# Altium project peggy-optical-board.PrjPcb
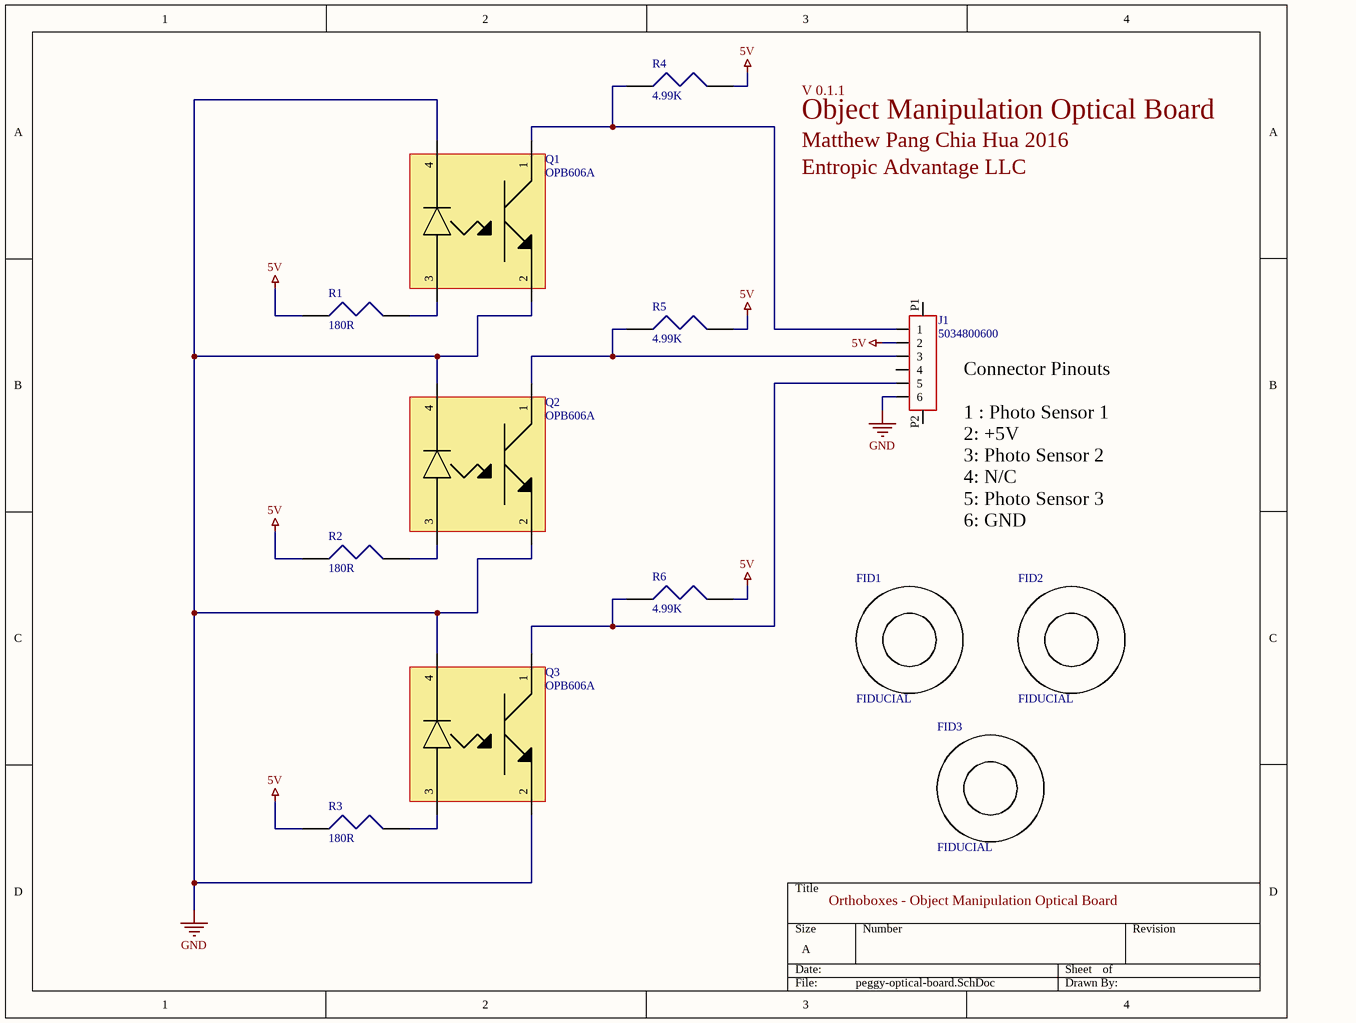
[diagram p0: peggy-optical-board.SchDoc]
1 sheet, 13 parts. Net scope: global (net labels, ports and power ports of the same name join across sheets).
Board file: peggy-optical-board.PcbDoc

## Sheet peggy-optical-board.SchDoc
size A

### Parts
FID1  FIDUCIAL  [FID]  (no BOM)
FID2  FIDUCIAL  [FID]  (no BOM)
FID3  FIDUCIAL  [FID]  (no BOM)
J1  5034800600  [MOLEX 503480-0600]
Q1  OPB606A  [OPB606A]
Q2  OPB606A  [OPB606A]
Q3  OPB606A  [OPB606A]
R1  180R  [RESC2012X07N_SAMSUNG]
R2  180R  [RESC2012X07N_SAMSUNG]
R3  180R  [RESC2012X07N_SAMSUNG]
R4  4.99K  [RESC2012X07N_SAMSUNG]
R5  4.99K  [RESC2012X07N_SAMSUNG]
R6  4.99K  [RESC2012X07N_SAMSUNG]

### Nets
5V: J1.2 R1.1 R2.1 R3.1 R4.2 R5.2 R6.2
GND: J1.6 Q1.2 Q1.4 Q2.2 Q2.4 Q3.2 Q3.4
NetJ1_1: J1.1 Q1.1 R4.1
NetJ1_3: J1.3 Q2.1 R5.1
NetJ1_5: J1.5 Q3.1 R6.1
NetQ1_3: Q1.3 R1.2
NetQ2_3: Q2.3 R2.2
NetQ3_3: Q3.3 R3.2

Not connected (* = marked no-connect by the designer): J1 4 P1 P2

### Notes on the sheet
- V 0.1.1
- Object Manipulation Optical Board
- Matthew Pang Chia Hua 2016
- Entropic Advantage LLC
- (near J1) Connector Pinouts
  1 : Photo Sensor 1
  2: +5V
  3: Photo Sensor 2
  4: N/C
  5: Photo Sensor 3
  6: GND
- Orthoboxes - Object Manipulation Optical Board

### Library data of the parts
FID1-FID3 = Fiducial 1
J1 = 5034800600: CONN FFC FPC 6POS 0.50MM R/A; Manufacturer: Molex, LLC; Flat Flex Type: FFC, FPC; Connector/Contact Type: Contacts, Top and Bottom; Number of Positions: 6; Pitch: 0.020" (0.50mm); FFC, FCB Thickness: 0.30mm; Locking Feature: Flip Lock, Backlock; Cable End Type: Straight, Tapered; Actuator Material: Polyamide (PA), Nylon, Glass Filled; Voltage Rating: 50V; Material Flammability Rating: UL94 V-0, UL94 HB; Current Rating: 0.5A; Supplier 1: Digi-Key; Manufacturer Part Number: 5034800600; RoHS: RoHS Compliant; Category: Connectors, Interconnects; Stock 1: 16110; Pricing 1: 1=0.81, 10=0.714, 25=0.672, 50=0.6438, 100=0.6159, 250=0.55992, 500=0.50392, 1000=0.44792 (USD); Packaging: Cut Tape (CT); Mounting Type: Surface Mount, Right Angle; Termination: Solder; Height Above Board: 0.039" (1.00mm); Contact Material: Phosphor Bronze; Contact Finish: Gold; Housing Material: Liquid Crystal Polymer (LCP), Glass Filled; Features: Solder Retention; Operating Temperature: -40°C ~ 85°C; ComponentLink1URL: http://www.molex.com/pdm_docs/sd/5034800600_sd.pdf; ComponentLink1Description: http://www.molex.com/pdm_docs/sd/5034800600_sd.pdf; Supplier Part Number 1: WM1387CT-ND
Q1-Q3 = OPB606A: SENSR OPTO TRANS 1.27MM REFL PCB; Manufacturer: TT Electronics/Optek Technology; Sensing Distance: 0.050" (1.27mm); Sensing Method: Reflective; Voltage - Collector Emitter Breakdown (Max): 30V; Current - Collector (Ic) (Max): 25mA; Current - DC Forward (If) (Max): 50mA; Output Type: Phototransistor; Supplier 1: Digi-Key; Manufacturer Part Number: OPB606A; RoHS: RoHS Compliant; Category: Sensors, Transducers; Stock 1: 1547; Pricing 1: 1=1.14, 100=1.09, 250=1.05, 500=1.01, 1000=0.98, 2500=0.94, 5000=0.91 (USD); Packaging: Bulk; Response Time: -; Mounting Type: Through Hole; Package / Case: PCB Mount; Operating Temperature: -40°C ~ 85°C; ComponentLink1URL: http://www.optekinc.com/datasheets/OPB606-607.PDF; ComponentLink1Description: http://www.optekinc.com/datasheets/OPB606-607.PDF; Supplier Part Number 1: 365-1088-ND
R1-R3 = RC2012F181CS: RES SMD 180 OHM 1% 1/8W 0805; Manufacturer: Samsung Electro-Mechanics America, Inc.; Resistance (Ohms): 180; Power (Watts): 0.125W, 1/8W; Temperature Coefficient: ±100ppm/°C; Supplier 1: Digi-Key; Manufacturer Part Number: RC2012F181CS; RoHS: RoHS Compliant; Category: Resistors; Stock 1: 7245; Pricing 1: 1=0.1, 10=0.022, 25=0.016, 50=0.0124, 100=0.0091, 500=0.00554, 1000=0.00408 (USD); Packaging: Cut Tape (CT); Tolerance: ±1%; Composition: Thick Film; Features: Moisture Resistant; Operating Temperature: -55°C ~ 155°C; Package / Case: 0805 (2012 Metric); Supplier Device Package: 0805 (2012 Metric); Size / Dimension: 0.079" L x 0.049" W (2.00mm x 1.25mm); Height: 0.024" (0.60mm); Number of Terminations: 2; ComponentLink1URL: http://media.digikey.com/pdf/Data%20Sheets/Samsung%20PDFs/RC_Series_ds.pdf; ComponentLink1Description: http://media.digikey.com/pdf/Data%20Sheets/Samsung%20PDFs/RC_Series_ds.pdf; Supplier Part Number 1: 1276-5232-1-ND
R4-R6 = RC2012F4991CS: RES SMD 4.99K OHM 1% 1/8W 0805; Manufacturer: Samsung Electro-Mechanics America, Inc.; Power (Watts): 0.125W, 1/8W; Temperature Coefficient: ±100ppm/°C; Supplier 1: Digi-Key; Manufacturer Part Number: RC2012F4991CS; RoHS: RoHS Compliant; Category: Resistors; Stock 1: 39876; Pricing 1: 1=0.1, 10=0.022, 25=0.016, 50=0.0124, 100=0.0091, 500=0.00554, 1000=0.00408 (USD); Packaging: Cut Tape (CT); Resistance (Ohms): 4.99k; Tolerance: ±1%; Composition: Thick Film; Features: Moisture Resistant; Operating Temperature: -55°C ~ 155°C; Package / Case: 0805 (2012 Metric); Supplier Device Package: 0805; Size / Dimension: 0.079" L x 0.049" W (2.00mm x 1.25mm); Height: 0.024" (0.60mm); Number of Terminations: 2; ComponentLink1URL: http://media.digikey.com/pdf/Data%20Sheets/Samsung%20PDFs/RC_Series_ds.pdf; ComponentLink1Description: http://media.digikey.com/pdf/Data%20Sheets/Samsung%20PDFs/RC_Series_ds.pdf; Supplier Part Number 1: 1276-5310-1-ND